# EAGLE design minimal-arduino-uno-rev3-02-th (EAGLE 7.3.0)
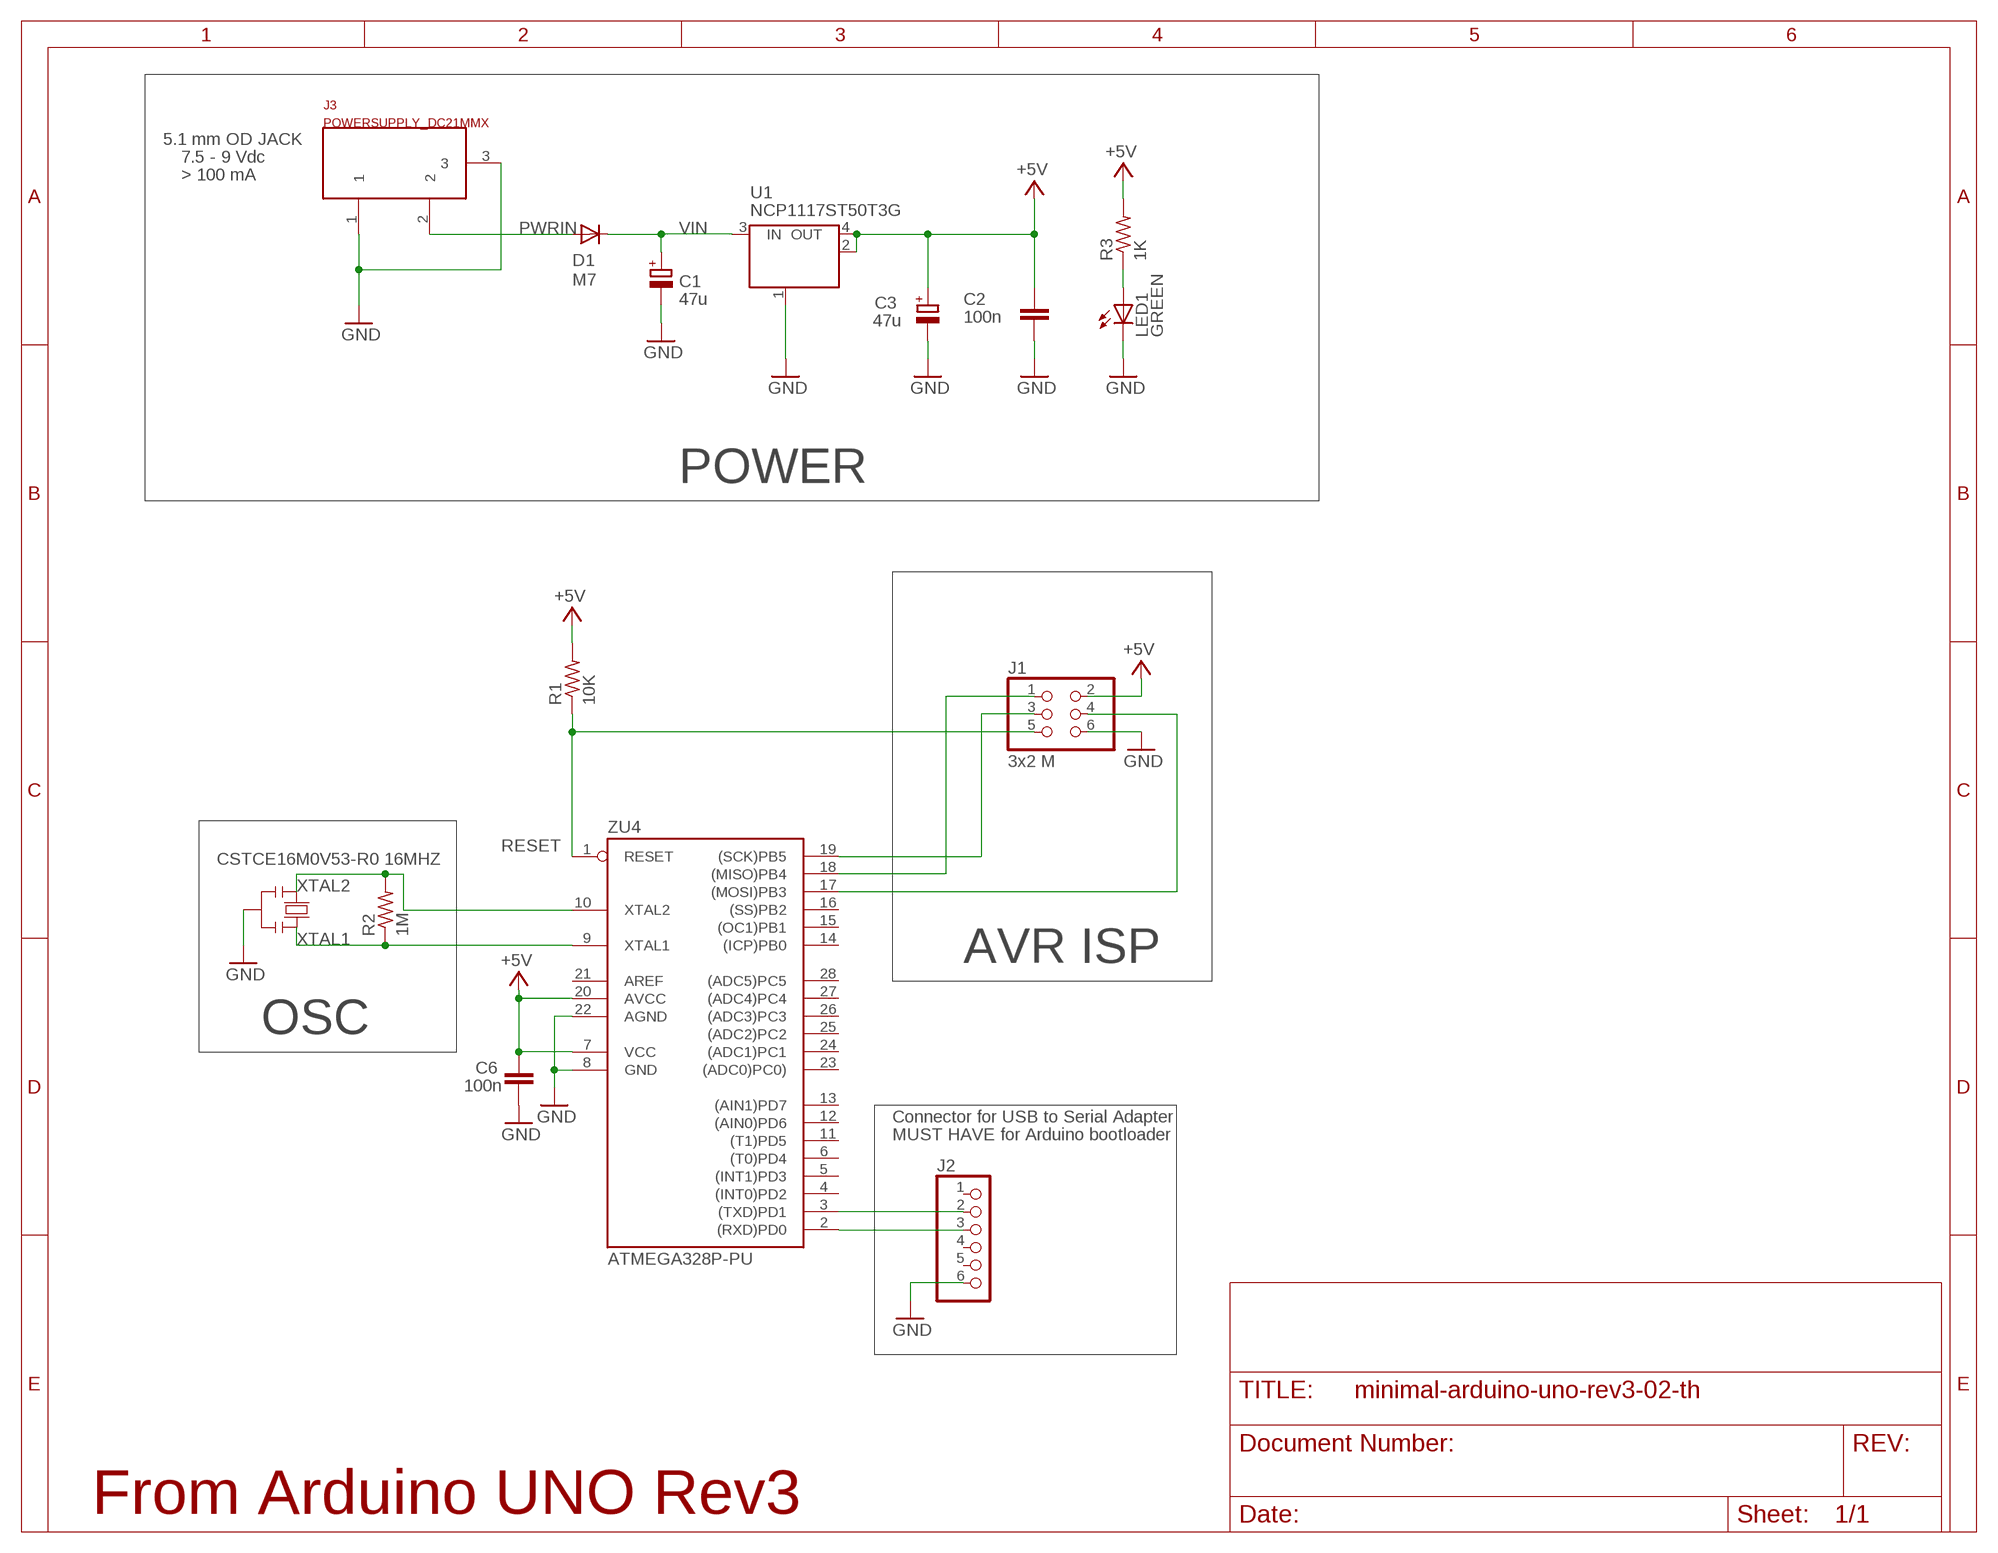
[diagram p0: schematic, sheet 1]

## Parts
C1  47u  CPOL-EUD  [PANASONIC_D]
C2  100n  C-EUC0805  [C0805]
C3  47u  CPOL-EUD  [PANASONIC_D]
C6  100n  C-EUC0805  [C0805]
D1  M7  DIODE-SMB  [SMB]
J1  3x2 M  PINHD-2X3  [2X03]
J2  PINHD-1X6  [1X06]
J3  POWERSUPPLY_DC21MMX  [POWERSUPPLY_DC-21MM]
LED1  GREEN  LEDCHIP-LED0805  [CHIP-LED0805]
R1  10K  R-US_R0805  [R0805]
R2  1M  R-US_R0805  [R0805]
R3  1K  R-US_R0805  [R0805]
U1  NCP1117ST50T3G  MC33269ST-3.3T3  [SOT223]
X1  CSTCE16M0V53-R0 16MHZ  RESONATORMU  [RESONATOR]
ZU4  ATMEGA328P-PU  [DIL28-3]

## Nets
+5V [usbvcc]: C2.2 C3.+ C6.2 J1.2 R1.2 R3.2 U1.2(OUT) U1.4(OUT) ZU4.7(VCC) ZU4.20(AVCC)
GND [gnd]: C1.- C2.1 C3.- C6.1 J1.6 J2.6 J3.1 J3.3 LED1.C U1.1(GND/ADJ) X1.2 ZU4.8(GND) ZU4.22(AGND)
MISO: J1.1 ZU4.18((MISO)PB4)
MOSI: J1.4 ZU4.17((MOSI)PB3)
N$1: J2.3 ZU4.2((RXD)PD0)
N$2: J2.2 ZU4.3((TXD)PD1)
N$3: LED1.A R3.1
PWRIN [power]: D1.A J3.2
RESET: J1.5 R1.1 ZU4.1(RESET)
SCK: J1.3 ZU4.19((SCK)PB5)
VIN [power]: C1.+ D1.C U1.3(IN)
XTAL1: R2.1 X1.3 ZU4.9(XTAL1)
XTAL2: R2.2 X1.1 ZU4.10(XTAL2)
Unconnected: J2.1 J2.4 J2.5 ZU4.4((INT0)PD2) ZU4.5((INT1)PD3) ZU4.6((T0)PD4) ZU4.11((T1)PD5) ZU4.12((AIN0)PD6) ZU4.13((AIN1)PD7) ZU4.14((ICP)PB0) ZU4.15((OC1)PB1) ZU4.16((SS)PB2) ZU4.21(AREF) ZU4.23((ADC0)PC0)) ZU4.24((ADC1)PC1) ZU4.25((ADC2)PC2) ZU4.26((ADC3)PC3) ZU4.27((ADC4)PC4) ZU4.28((ADC5)PC5)

## Notes on the sheet
- 5.1 mm OD JACK
- 7.5 - 9 Vdc
- > 100 mA
- POWER
- AVR ISP
- OSC
- Connector for USB to Serial Adapter
- MUST HAVE for Arduino bootloader
- From Arduino UNO Rev3

## Library data of the parts
C1 C3 = rcl:CPOL-EU: POLARIZED CAPACITOR, European symbol
C2 C6 = rcl:C-EU: CAPACITOR, European symbol
D1 = diode:DIODE-: DIODE
J1 = SmartPrj:PINHD-2X3: PIN HEADER
J2 = pinhead:PINHD-1X6: PIN HEADER
J3 = SmartPrj:POWERSUPPLY_DC21MM
LED1 = led:LED: LED OSRAM: - CHIPLED LG R971, LG N971, LY N971, LG Q971, LY Q971, LO R971, LY R971 LH N974, LH R974 LS Q976, LO Q976, LY Q976 LO Q996 - Hyper CHIPLED LW Q18S LB Q993, LB Q99A, LB R99A - SideLED LS A670, LO A670, LY A670, LG A670, LP A670 LB A673, LV A673, LT A673, LW A673 LH A674 LY A675 LS A676, LA A676, LO A676, LY A676, LW A676 LS A679, LY A679, LG A679 - Hyper Micro SIDELED® LS Y876, LA Y876, LO Y876, LY Y876 LT Y87S - SmartLED LW L88C, LW L88S LB L89C, LB L89S, LG L890 LS L89K, LO L89K, LY L89K LS L896, LA L896, LO L896, LY L896 - TOPLED LS T670, LO T670, LY T670, LG T670, LP T670 LSG T670, LSP T670, LSY T670, LOP T670, LYG T670 LG T671, LOG T671, LSG T671 LB T673, LV T673, LT T673, LW T673 LH T674 LS T676, LA T676, LO T676, LY T676, LB T676, LH T676, LSB T676, LW T676 LB T67C, LV T67C, LT T67C, LS T67K, LO T67K, LY T67K, LW E67C LS E67B, LA E67B, LO E67B, LY E67B, LB E67C, LV E67C, LT E67C LW T67C LS T679, LY T679, LG T679 LS T770, LO T770, LY T770, LG T770, LP T770 LB T773, LV T773, LT T773, LW T773 LH T774 LS E675, LA E675, LY E675, LS T675 LS T776, LA T776, LO T776, LY T776, LB T776 LHGB T686 LT T68C, LB T68C - Hyper Mini TOPLED® LB M676 - Mini TOPLED Santana® LG M470 LS M47K, LO M47K, LY M47K Source: http://www.osram.convergy.de LUXEON: - LUMILED® LXK2-PW12-R00, LXK2-PW12-S00, LXK2-PW14-U00, LXK2-PW14-V00 LXK2-PM12-R00, LXK2-PM12-S00, LXK2-PM14-U00 LXK2-PE12-Q00, LXK2-PE12-R00, LXK2-PE12-S00, LXK2-PE14-T00, LXK2-PE14-U00 LXK2-PB12-K00, LXK2-PB12-L00, LXK2-PB12-M00, LXK2-PB14-N00, LXK2-PB14-P00, LXK2-PB14-Q00 LXK2-PR12-L00, LXK2-PR12-M00, LXK2-PR14-Q00, LXK2-PR14-R00 LXK2-PD12-Q00, LXK2-PD12-R00, LXK2-PD12-S00 LXK2-PH12-R00, LXK2-PH12-S00 LXK2-PL12-P00, LXK2-PL12-Q00, LXK2-PL12-R00 Source: www.luxeon.com KINGBRIGHT: KA-3528ASYC Source: www.kingbright.com
R1-R3 = rcl:R-US_: RESISTOR, American symbol
U1 = linear:MC33269ST*: Adjustable Output Low Dropout Voltage Regulator 800 mA Source: http://www.onsemi.com/pub/Collateral/MC33269-D.PDF
X1 = SmartPrj:RESONATOR
ZU4 = SmartPrj:ATMEGA328P-: MICROCONTROLLER 4 Kbytes FLASH 128 bytes SRAM 256 bytes EEPROM UART 6-channel 10 bit ADC

## Net classes
0 default: width 0.254 mm, clearance 0.254 mm
1 power: width 0.61 mm, drill 0.61 mm, clearance 0.254 mm
2 gnd: width 0.305 mm, drill 0.559 mm, clearance 0.254 mm
3 usbvcc: width 0.508 mm, drill 0.61 mm, clearance 0.254 mm
4 aref: width 0.406 mm, drill 0.61 mm, clearance 0.254 mm

## Board
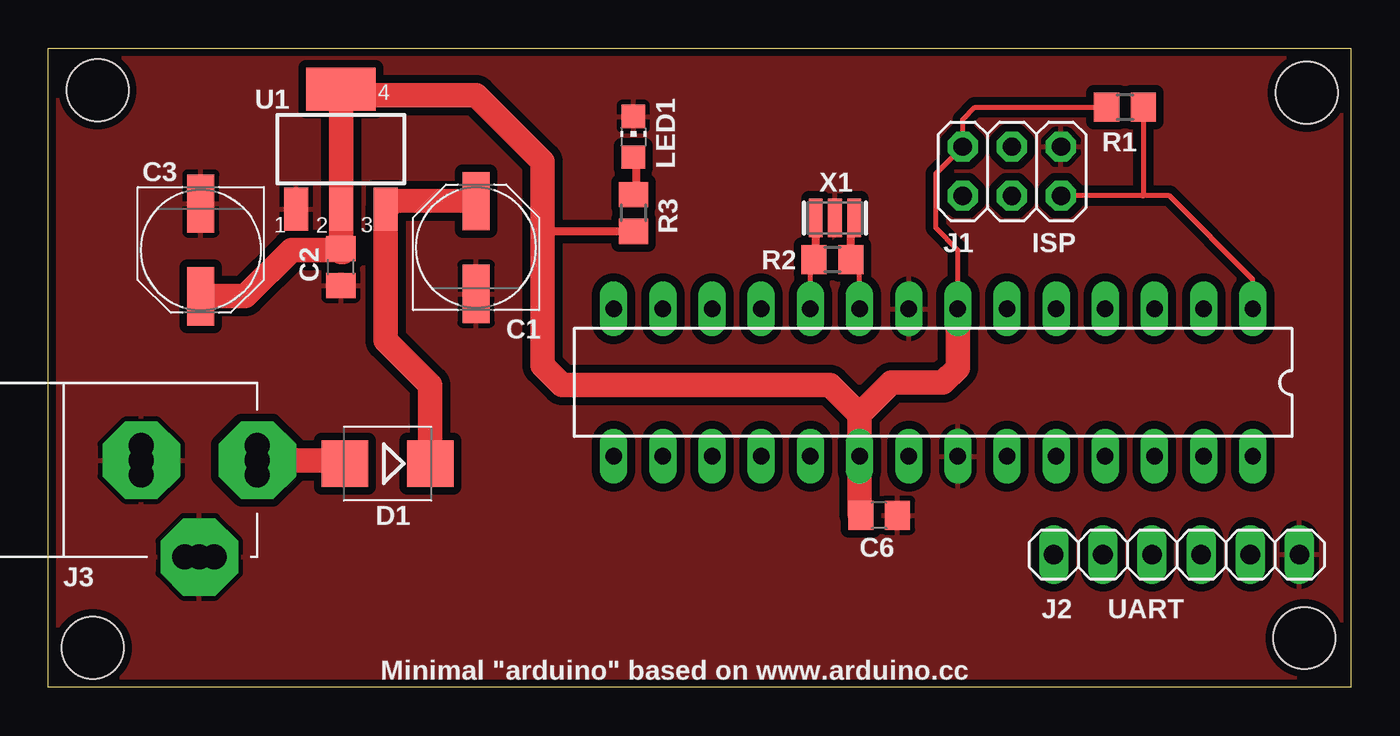
[diagram p1: board, top side]
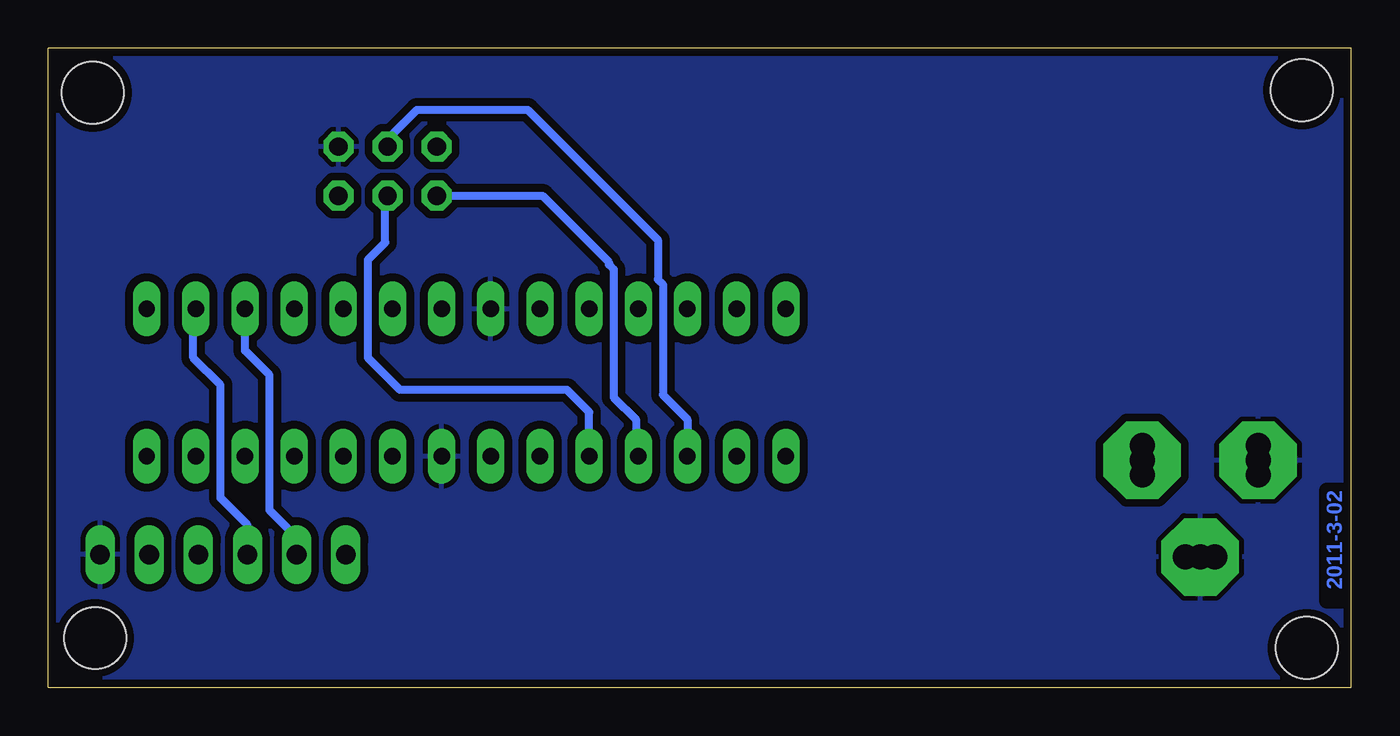
[diagram p2: board, bottom side, seen from below]

Size 67.31 x 33.02 mm. Coordinates in mm from the lower left corner, seen from the top.
Outline: 0,0 0,33.02 67.31,33.02 67.31,0 0,0
Copper layers (1*16): Top 0.0356mm / dielectric 1.5011mm / Bottom 0.0356mm
Design rules "OSH-Park-2-layer": minimum track width 6mil, minimum drill 13mil, track to track 6mil, track to pad 6mil, pad to pad 6mil, via to via 6mil, smd to smd 6mil, copper to edge 15mil, drill to drill 6mil, minimum pad ring 7mil, minimum via ring 7mil, stop-mask expansion 3mil, vias tented up to drill 0mil, thermal gap 10mil
Holes 3.2 mm at 65.02,30.73 64.9,2.54 2.54,30.86 2.29,2.03

### Footprints (pad centres in the part's own frame; a part is rotated, then mirrored left to right if it is on the bottom)
PANASONIC_D = smd 3 x 1.4: + 2.4,0; - -2.4,0
C0805 = smd 1.3 x 1.5: 1 -0.95,0; 2 0.95,0
SMB = smd 2.4 x 2.4: A 2.2,0; C -2.2,0
2X03 = drill 0.95 pad 1.55 octagon: 1 -2.54,-1.27; 2 -2.54,1.27; 3 0,-1.27; 4 0,1.27; 5 2.54,-1.27; 6 2.54,1.27
1X06 = drill 1.016 long: 1 -6.35,0; 2 -3.81,0; 3 -1.27,0; 4 1.27,0; 5 3.81,0; 6 6.35,0
POWERSUPPLY_DC-21MM = drill 1.3 pad 4 octagon: 1 -5.08,-3.353; 2 -0.076,-6.35; 3 -0.076,-0.356 | drill 1.3: 4 -5.08,-4.115; 5 -5.08,-2.591; 6 -0.838,-0.356; 7 0.686,-0.356; 8 -0.838,-6.35; 9 0.686,-6.35
CHIP-LED0805 = smd 1.2 x 1.2: A 0,-1.05; C 0,1.05
R0805 = smd 1.3 x 1.5: 1 -0.95,0; 2 0.95,0
SOT223 = smd 1.219 x 2.235: 1 -2.311,-3.099; 2 0,-3.099; 3 2.311,-3.099 | smd 3.6 x 2.2: 4 0,3.099
RESONATOR = smd 0.7 x 2: 1 -1,0; 2 0,0; 3 1,0
DIL28-3 = drill 0.85 pad 1.422 long: 1 -16.51,-3.81; 2 -13.97,-3.81; 3 -11.43,-3.81; 4 -8.89,-3.81; 5 -6.35,-3.81; 6 -3.81,-3.81; 7 -1.27,-3.81; 8 1.27,-3.81; 9 3.81,-3.81; 10 6.35,-3.81; 11 8.89,-3.81; 12 11.43,-3.81; 13 13.97,-3.81; 14 16.51,-3.81; 15 16.51,3.81; 16 13.97,3.81; 17 11.43,3.81; 18 8.89,3.81; 19 6.35,3.81; 20 3.81,3.81; 21 1.27,3.81; 22 -1.27,3.81; 23 -3.81,3.81; 24 -6.35,3.81; 25 -8.89,3.81; 26 -11.43,3.81; 27 -13.97,3.81; 28 -16.51,3.81

### Placement (x,y rotation side)
C1  22.1,22.73 90 top
C2  15.11,21.72 90 top
C3  7.87,22.61 270 top
C6  42.93,8.89 180 top
D1  17.53,11.56 180 top
J1  49.78,26.67 0 top
J2  58.29,6.86 0 top
J3  4.45,11.81 90 top
LED1  30.23,28.45 0 top
R1  55.63,29.97 180 top
R2  40.51,22.1 180 top
R3  30.23,24.51 270 top
U1  15.11,27.81 0 top
X1  40.64,24.26 0 top
ZU4  45.72,15.75 180 top

### Tracks (layer width: path | path; a pad name or v marks a point on that pad's centre or on a via)
+5V
  Top 0.254: ZU4.7 46.99,22.61 45.85,23.75 45.85,26.54 J1.2 47.24,29.34 47.88,29.97 54.48,29.97 R1.2 54.89,29.97
  Top 0.406: R3.2 25.65,23.56 25.65,23.62 25.53,23.62
  Top 1.27: 41.91,12.06 ZU4.20 | ZU4.7 46.99,16.51 46.23,15.75 43.56,15.75 41.91,14.1 | 41.91,14.1 ZU4.20 | 41.91,14.1 40.39,15.62 26.54,15.62 25.53,16.64 25.53,23.62 25.53,27.18 22.1,30.61 15.24,30.61 | 15.24,22.48 C2.2 | 14.99,22.61 15.11,22.73 U1.2 15.11,30.48 15.24,30.61 | 14.99,22.61 C2.2 | 15.24,30.61 15.24,30.79 U1.4 | C3.+ 10.17,20.21 12.57,22.61 14.99,22.61 | 14.99,22.61 15.11,22.48 C2.2 | ZU4.20 41.91,8.96 C6.2
GND
  pour Bottom (isolate 0.406, rank 2): 0,33.02 67.06,33.02 67.31,32.77 67.31,0 0.25,0 0,0.25
  pour Top (isolate 0.406, rank 2): 0,33.02 67.31,33.02 67.31,0 0,0 -0.13,29.84
MISO
  Bottom 0.406: J1.1 41.78,25.4 38.35,21.97 38.35,21.84 38.1,21.59 38.1,14.99 36.96,13.84 36.96,12.06 ZU4.18
MOSI
  Bottom 0.406: J1.4 49.78,28.32 48.26,29.84 42.55,29.84 35.81,23.11 35.81,21.08 35.56,20.83 35.56,15.11 34.29,13.84 ZU4.17 34.29,11.81
N$1
  Bottom 0.406: J2.3 57.02,8.38 58.42,9.78 58.42,15.62 59.82,17.02 59.82,19.56 59.69,19.68 ZU4.2
N$2
  Bottom 0.406: J2.2 54.48,7.75 55.88,9.14 55.88,16.13 57.15,17.4 ZU4.3 | ZU4.3 57.28,19.68 57.28,19.43 ZU4.3
N$3
  Top 0.406: LED1.A 30.35,27.4 30.35,25.53 30.23,25.53 R3.1
PWRIN
  Top 1.27: J3.2 15.32,11.73 15.49,11.56 D1.A
RESET
  Top 0.254: ZU4.1 62.23,21.08 57.91,25.4 56.58,25.4 | J1.5 56.52,25.4 56.58,25.4 | R1.1 56.58,25.4
SCK
  Bottom 0.406: ZU4.19 39.37,14.22 40.51,15.37 49.15,15.37 50.8,17.02 50.8,22.1 49.91,22.99 49.91,25.27 J1.3
VIN
  Top 1.27: D1.C 19.73,15.62 17.42,17.92 U1.3 17.87,25.16 C1.+
XTAL1
  Top 0.254: ZU4.9 41.91,21.72 | 41.53,24.15 X1.3
  Top 0.406: 41.91,21.72 41.53,22.1 R2.1 41.46,23.43 41.53,23.5 41.53,24.15 | 41.53,24.15 41.53,24.51 41.66,24.64 41.66,24.02 | 41.66,23.88 41.66,24.02 | 41.66,24.02 41.53,24.15
XTAL2
  Top 0.254: ZU4.10 39.37,21.72 | 39.75,24.51 39.75,24.37 X1.1
  Top 0.406: X1.1 39.64,22.11 39.56,22.04 | 39.37,21.72 39.5,21.84 39.5,21.97 39.56,22.04 | R2.2 39.56,22.04

### Text on the board
Bottom: 2011-3-02
tPlace: ISP | UART
tNames: Minimal "arduino" based on www.arduino.cc
214bmp: D:/SmartProjects/Snc/a4_bn_logo2.bmp